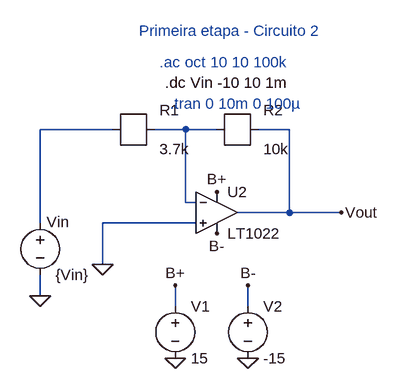
[diagram p0: schematic Lab3_1_2.asc]
Lab3_1_2.asc, the LTspice schematic file:
Version 4
SHEET 1 880 680
WIRE 256 224 144 224
WIRE 368 224 320 224
WIRE 416 224 368 224
WIRE 528 224 480 224
WIRE 368 336 368 224
WIRE 384 336 368 336
WIRE 528 352 528 224
WIRE 528 352 448 352
WIRE 608 352 528 352
WIRE 144 368 144 224
WIRE 384 368 240 368
WIRE 240 432 240 368
WIRE 144 480 144 448
WIRE 352 496 352 464
WIRE 464 496 464 464
FLAG 464 576 0
FLAG 352 576 0
FLAG 464 464 B-
FLAG 352 464 B+
FLAG 416 384 B-
FLAG 416 320 B+
FLAG 144 480 0
FLAG 608 352 Vout
FLAG 240 432 0
SYMBOL opamps/LT1022 416 288 R0
SYMATTR InstName U2
SYMBOL voltage 352 480 R0
SYMATTR InstName V1
SYMATTR Value 15
SYMBOL voltage 464 480 R0
SYMATTR InstName V2
SYMATTR Value -15
SYMBOL r 256 224 R0
SYMATTR InstName R1
SYMATTR Value 3.7k
SYMBOL r 416 224 R0
SYMATTR InstName R2
SYMATTR Value 10k
SYMBOL voltage 144 352 R0
WINDOW 0 10 14 Left 2
SYMATTR InstName Vin
SYMATTR Value {Vin}
SYMATTR Value2 AC 1
TEXT 336 152 Left 2 !.dc Vin -10 10 1m
TEXT 328 120 Left 2 ;.ac oct 10 10 100k
TEXT 344 184 Left 2 ;.tran 0 10m 0 100µ
TEXT 296 72 Left 2 ;Primeira etapa - Circuito 2

The netlist it stands for:
* Lab3_1_2.asc
XU2 0 N002 B+ B- Vout LT1022  ; pins In+ In- V+ V- OUT
V1 B+ 0 15
V2 B- 0 -15
R1 N002 N001 3.7k
R2 Vout N002 10k
Vin N001 0 {Vin} AC 1
.dc Vin -10 10 1m
* .ac oct 10 10 100k
* .tran 0 10m 0 100µ
* Primeira etapa - Circuito 2
.backanno
.end